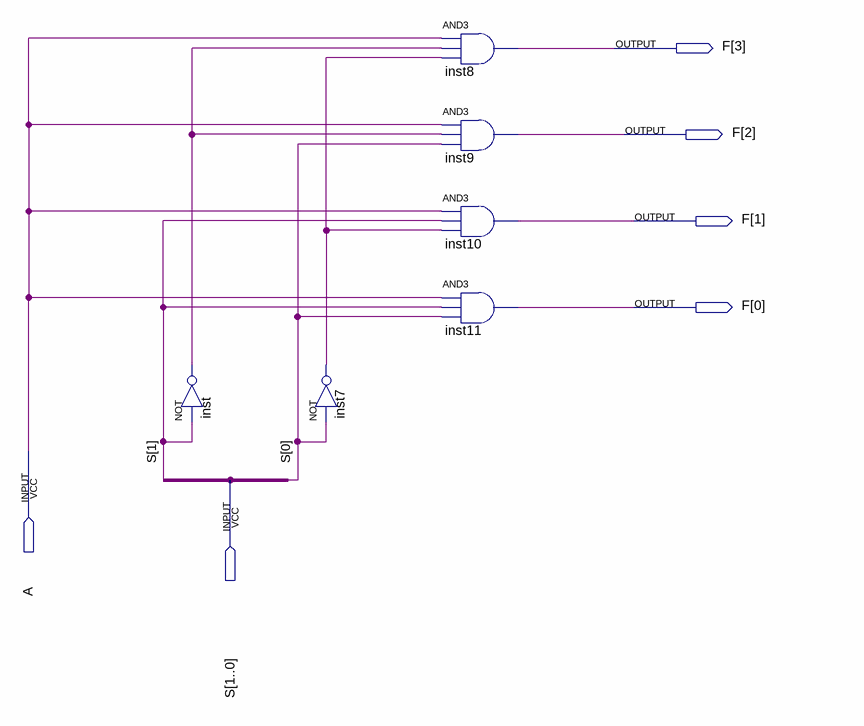
[diagram p0: schematic sheet]
// Quartus schematic demux.bdf as structural Verilog: 6 symbols, 6 pins
module demux (
  input  A,
  input  [1:0] S,
  output [3:0] F
);

  wire inst7_out, inst_out;

  not inst (inst_out, S[1]);
  not inst7 (inst7_out, S[0]);
  and inst8 (F[3], A, inst_out, inst7_out);
  and inst9 (F[2], A, inst_out, S[0]);
  and inst10 (F[1], A, S[1], inst7_out);
  and inst11 (F[0], A, S[1], S[0]);
endmodule
